# EAGLE design Audio_amp (EAGLE 5.07)
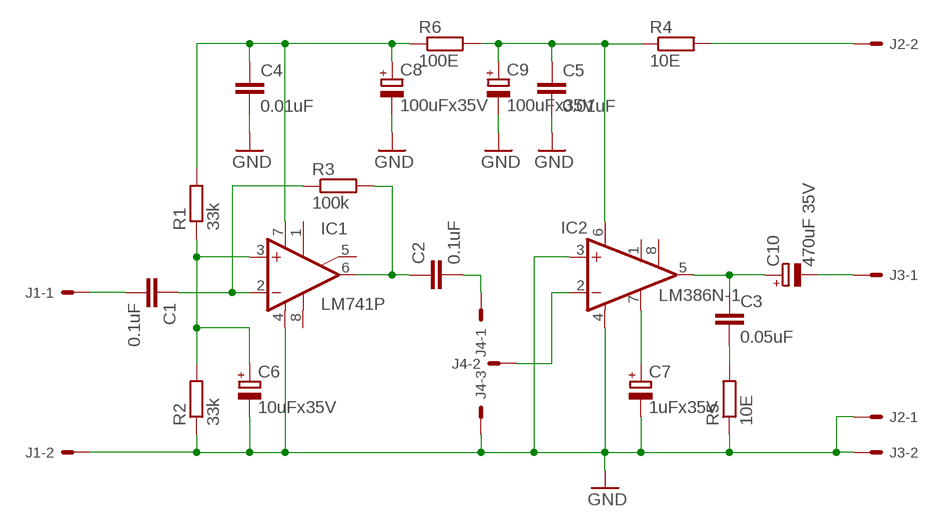
[diagram p0: schematic, sheet 1]

## Parts
C1  0.1uF  C-EU050-035X075  [C050-035X075]
C2  0.1uF  C-EU050-035X075  [C050-035X075]
C3  0.05uF  C-EU050-035X075  [C050-035X075]
C4  0.01uF  C-EU050-035X075  [C050-035X075]
C5  0.01uF  C-EU050-035X075  [C050-035X075]
C6  10uFx35V  CPOL-EUE2.5-6  [E2,5-6]
C7  1uFx35V  CPOL-EUE2.5-6  [E2,5-6]
C8  100uFx35V  CPOL-EUE2.5-6  [E2,5-6]
C9  100uFx35V  CPOL-EUE2.5-6  [E2,5-6]
C10  470uF 35V  CPOL-EUE3.5-8  [E3,5-8]
IC1  LM741P  [DIL08]
IC2  LM386N-1  [DIL08]
J1  22-27-2021-02  [6410-02]
J2  22-27-2021-02  [6410-02]
J3  22-27-2021-02  [6410-02]
J4  22-27-2031-03  [6410-03]
R1  33k  R-EU_0207/12  [0207/12]
R2  33k  R-EU_0207/12  [0207/12]
R3  100k  R-EU_0207/12  [0207/12]
R4  10E  R-EU_0207/12  [0207/12]
R5  10E  R-EU_0207/12  [0207/12]
R6  100E  R-EU_0207/12  [0207/12]

## Nets
GND: C4.2 C5.2 C6.- C7.- C8.- C9.- IC1.4(V-) IC2.3(+IN) IC2.4(GND) J1.2 J2.1 J3.2 J4.3 R2.1 R5.1
N$1: J2.2 R4.2
N$2: C6.+ IC1.3(+IN) R1.1 R2.2
N$3: C2.1 IC1.6(OUT) R3.2
N$4: C1.1 IC1.2(-IN) R3.1
N$5: C1.2 J1.1
N$6: C2.2 J4.1
N$7: IC2.2(-IN) J4.2
N$8: C7.+ IC2.7(BYPASS)
N$9: C3.1 C10.+ IC2.5(OUT)
N$10: C3.2 R5.2
N$11: C10.- J3.1
N$12: C5.1 C9.+ IC2.6(VS) R4.1 R6.2
N$13: C4.1 C8.+ IC1.7(V+) R1.2 R6.1
Unconnected: IC1.1(ON1) IC1.5(ON2) IC1.8(OPT) IC2.1(GAIN) IC2.8(GAIN)

## Library data of the parts
C1-C5 = rcl:C-EU: CAPACITOR, European symbol
C6-C10 = rcl:CPOL-EU: POLARIZED CAPACITOR, European symbol
IC1 = linear:*741: OP AMP
IC2 = linear:LM386?-*: Low Voltage Audio Power Amplifier Source: http://cache.national.com/ds/LM/LM386.pdf
J1-J3 = con-molex:22-?-02: CONNECTOR wire to board 2.54 mm (.1 inch) pitch header
J4 = con-molex:22-?-03: CONNECTOR wire to board 2.54 mm (.1 inch) pitch header
R1-R6 = rcl:R-EU_: RESISTOR, European symbol

## Board
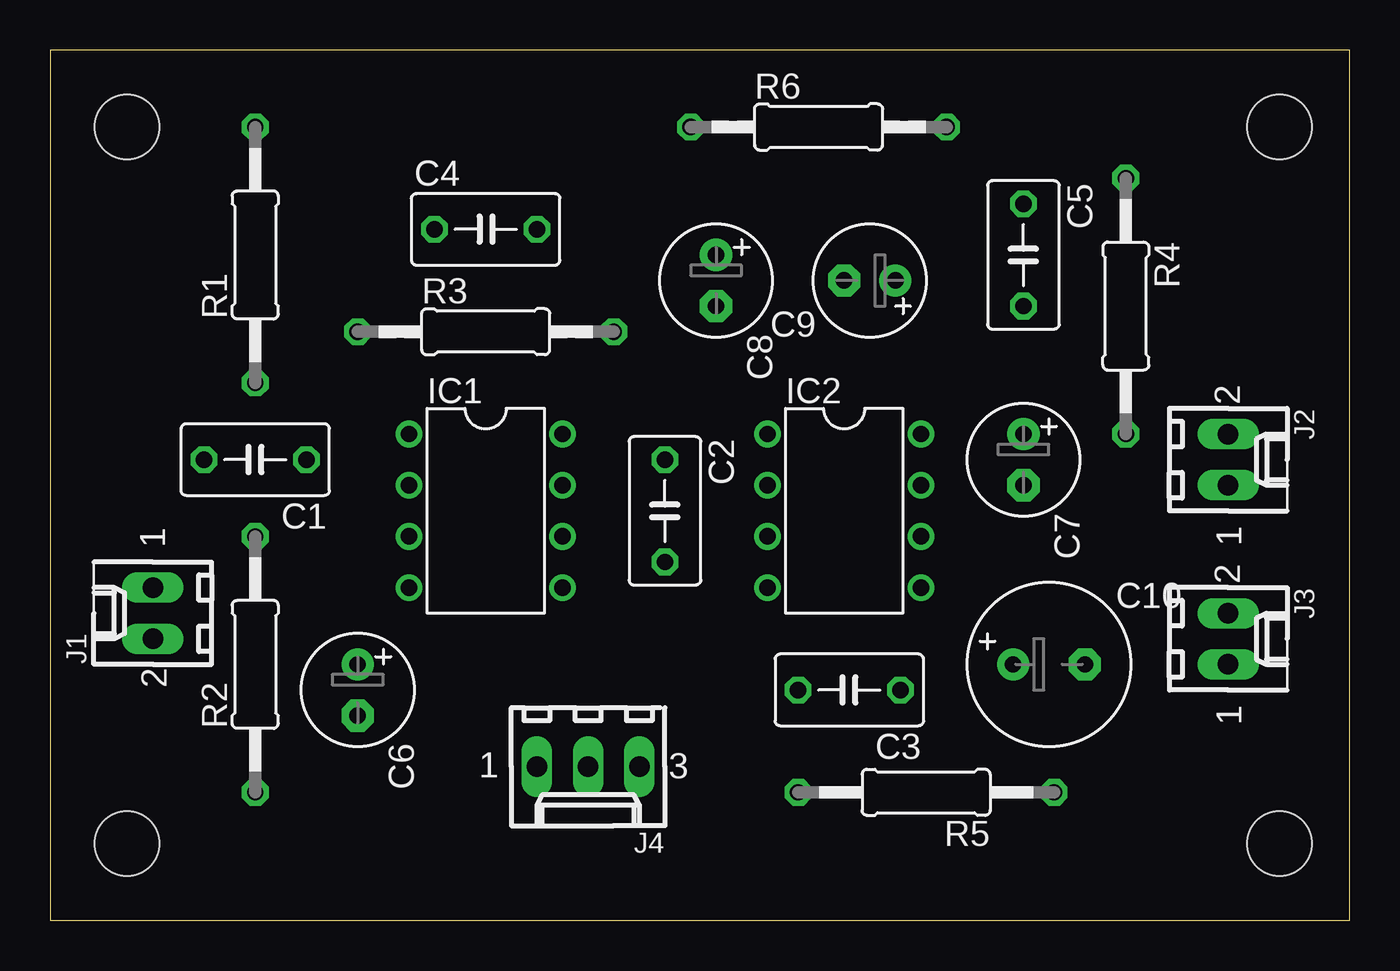
[diagram p1: board, top side]
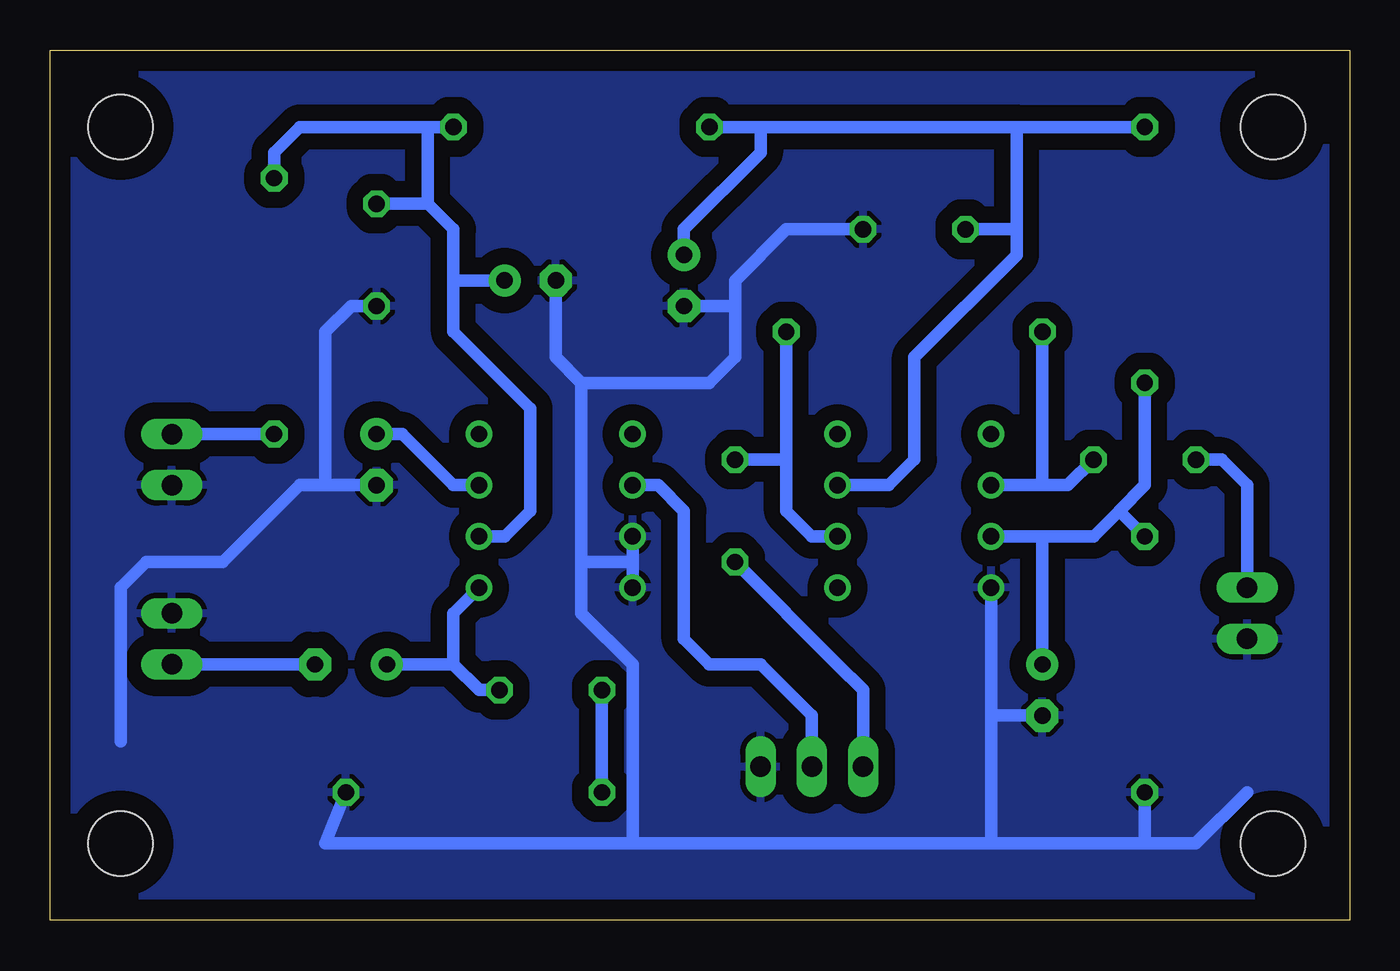
[diagram p2: board, bottom side, seen from below]

Size 64.44 x 43.17 mm. Coordinates in mm from the lower left corner, seen from the top.
Outline: 0,0 64.44,0 64.44,43.17 0,43.17 0,0
Copper layers (1*16): Top 0.035mm / dielectric 1.5mm / Bottom 0.035mm
Design rules "default": minimum track width 10mil, minimum drill 24mil, track to track 8mil, track to pad 8mil, pad to pad 8mil, via to via 8mil, smd to smd 8mil, copper to edge 40mil, drill to drill 8mil, minimum pad ring 10mil, minimum via ring 8mil, stop-mask expansion 4mil, vias tented up to drill 0mil, thermal gap 10mil
Holes 3.2 mm at 3.81,39.37 60.96,39.37 60.96,3.81 3.81,3.81

### Footprints (pad centres in the part's own frame; a part is rotated, then mirrored left to right if it is on the bottom)
C050-035X075 = drill 0.813 octagon: 1 -2.54,0; 2 2.54,0
E2,5-6 = drill 0.813 pad 1.6 round: + -1.27,0 | drill 0.813 pad 1.6 octagon: - 1.27,0
E3,5-8 = drill 0.813 pad 1.6 round: + -1.778,0 | drill 0.813 pad 1.6 octagon: - 1.778,0
DIL08 = drill 0.813 pad 1.27 round: 1 -3.81,-3.81; 2 -1.27,-3.81; 3 1.27,-3.81; 4 3.81,-3.81; 5 3.81,3.81; 6 1.27,3.81; 7 -1.27,3.81; 8 -3.81,3.81
6410-02 = drill 1.016 long: 1 1.27,0; 2 -1.27,0
6410-03 = drill 1.016 long: 1 2.54,0; 2 0,0; 3 -2.54,0
0207/12 = drill 0.813 octagon: 1 -6.35,0; 2 6.35,0

### Placement (x,y rotation side)
C1  10.16,22.86 180 top
C2  30.48,20.32 270 top
C3  39.62,11.43 180 top
C4  21.59,34.29 0 top
C5  48.26,33.02 270 top
C6  15.24,11.43 270 top
C7  48.26,22.86 270 top
C8  33.02,31.75 270 top
C9  40.64,31.75 180 top
C10  49.53,12.7 0 top
IC1  21.59,20.32 270 top
IC2  39.37,20.32 270 top
J1  5.08,15.24 90 top
J2  58.42,22.86 270 top
J3  58.42,13.97 270 top
J4  26.67,7.62 180 top
R1  10.16,33.02 90 top
R2  10.16,12.7 90 top
R3  21.59,29.21 0 top
R4  53.34,30.48 270 top
R5  43.43,6.35 180 top
R6  38.1,39.37 0 top

### Tracks (layer width: path | path; a pad name or v marks a point on that pad's centre or on a via)
GND
  Bottom 0.61: 35.56,17.78 IC2.4 | 35.56,17.78 IC2.3 | 17.78,10.16 IC1.4 | 17.78,10.16 C6.- | 50.8,21.59 52.07,21.59 55.88,17.78 58.42,17.78 59.69,17.78 60.96,16.51 60.96,10.16 60.96,8.89 | C7.- 50.8,21.59 | C4.2 27.94,34.29 30.48,31.75 30.48,30.48 | 38.1,17.78 38.1,26.67 | 38.1,26.67 39.37,27.94 C9.- | 38.1,17.78 38.1,15.24 35.56,12.7 35.56,3.81 | 38.1,17.78 35.56,17.78 | 10.16,3.81 7.62,3.81 5.08,6.35 | 10.16,3.81 17.78,3.81 | 10.16,3.81 R2.1 | 17.78,3.81 17.78,10.16 | 17.78,3.81 29.21,3.81 31.75,3.81 35.56,3.81 | 35.56,3.81 50.8,3.81 R5.1 | 30.48,30.48 30.48,27.94 31.75,26.67 38.1,26.67 | 30.48,30.48 C8.- | C5.2 49.53,30.48 50.8,29.21 50.8,21.59
  pour Bottom (isolate 0.813): 0.51,42.67 64.01,42.67 64.01,0.51 0.51,0.51
N$1
  Bottom 0.61: R4.2 J2.2
N$2
  Bottom 0.61: 15.24,19.05 IC1.3 | 15.24,19.05 C6.+ | R1.1 10.16,21.59 11.43,20.32 | 11.43,20.32 12.7,19.05 15.24,19.05 | R2.2 11.43,20.32
N$3
  Bottom 0.61: IC1.6 26.67,19.05 27.94,20.32 27.94,22.86 | 27.94,22.86 C2.1 | 27.94,22.86 R3.2
N$4
  Bottom 0.61: 15.24,21.59 IC1.2 | 15.24,21.59 13.97,21.59 C1.1 | 15.24,21.59 R3.1
N$5
  Bottom 0.61: C1.2 6.35,22.86 5.08,21.59 J1.1
N$6
  Bottom 0.61: C2.2 25.4,12.7 24.13,11.43 J4.1
N$7
  Bottom 0.61: IC2.2 34.29,21.59 33.02,20.32 33.02,13.97 31.75,12.7 29.21,12.7 26.67,10.16 J4.2
N$8
  Bottom 0.61: IC2.7 44.45,21.59 46.99,24.13 C7.+
N$9
  Bottom 0.61: 44.45,12.7 44.45,15.24 IC2.5 | 44.45,12.7 C10.+ | C3.1 43.18,11.43 44.45,12.7
N$10
  Bottom 0.61: R5.2 C3.2
N$11
  Bottom 0.61: C10.- J3.1
N$12
  Bottom 0.61: 45.72,39.37 R6.2 | R4.1 53.34,38.1 52.07,39.37 45.72,39.37 | IC2.6 41.91,19.05 40.64,20.32 40.64,25.4 44.45,29.21 44.45,31.75 | 45.72,35.56 45.72,39.37 | 45.72,35.56 C5.1 | 44.45,31.75 44.45,34.29 45.72,35.56 | 44.45,31.75 C9.+
N$13
  Bottom 0.61: 16.51,34.29 C4.1 | 16.51,34.29 16.51,33.02 21.59,27.94 21.59,22.86 22.86,21.59 IC1.7 | 16.51,39.37 R1.2 | 16.51,34.29 16.51,39.37 | 16.51,39.37 29.21,39.37 | 29.21,39.37 R6.1 | C8.+ 33.02,34.29 29.21,38.1 29.21,39.37